# EasyEDA Pro project ProPrj_ProDoc_Board_AI8051U_20240829A_2024-08-30.epro, board PCB_20240829A
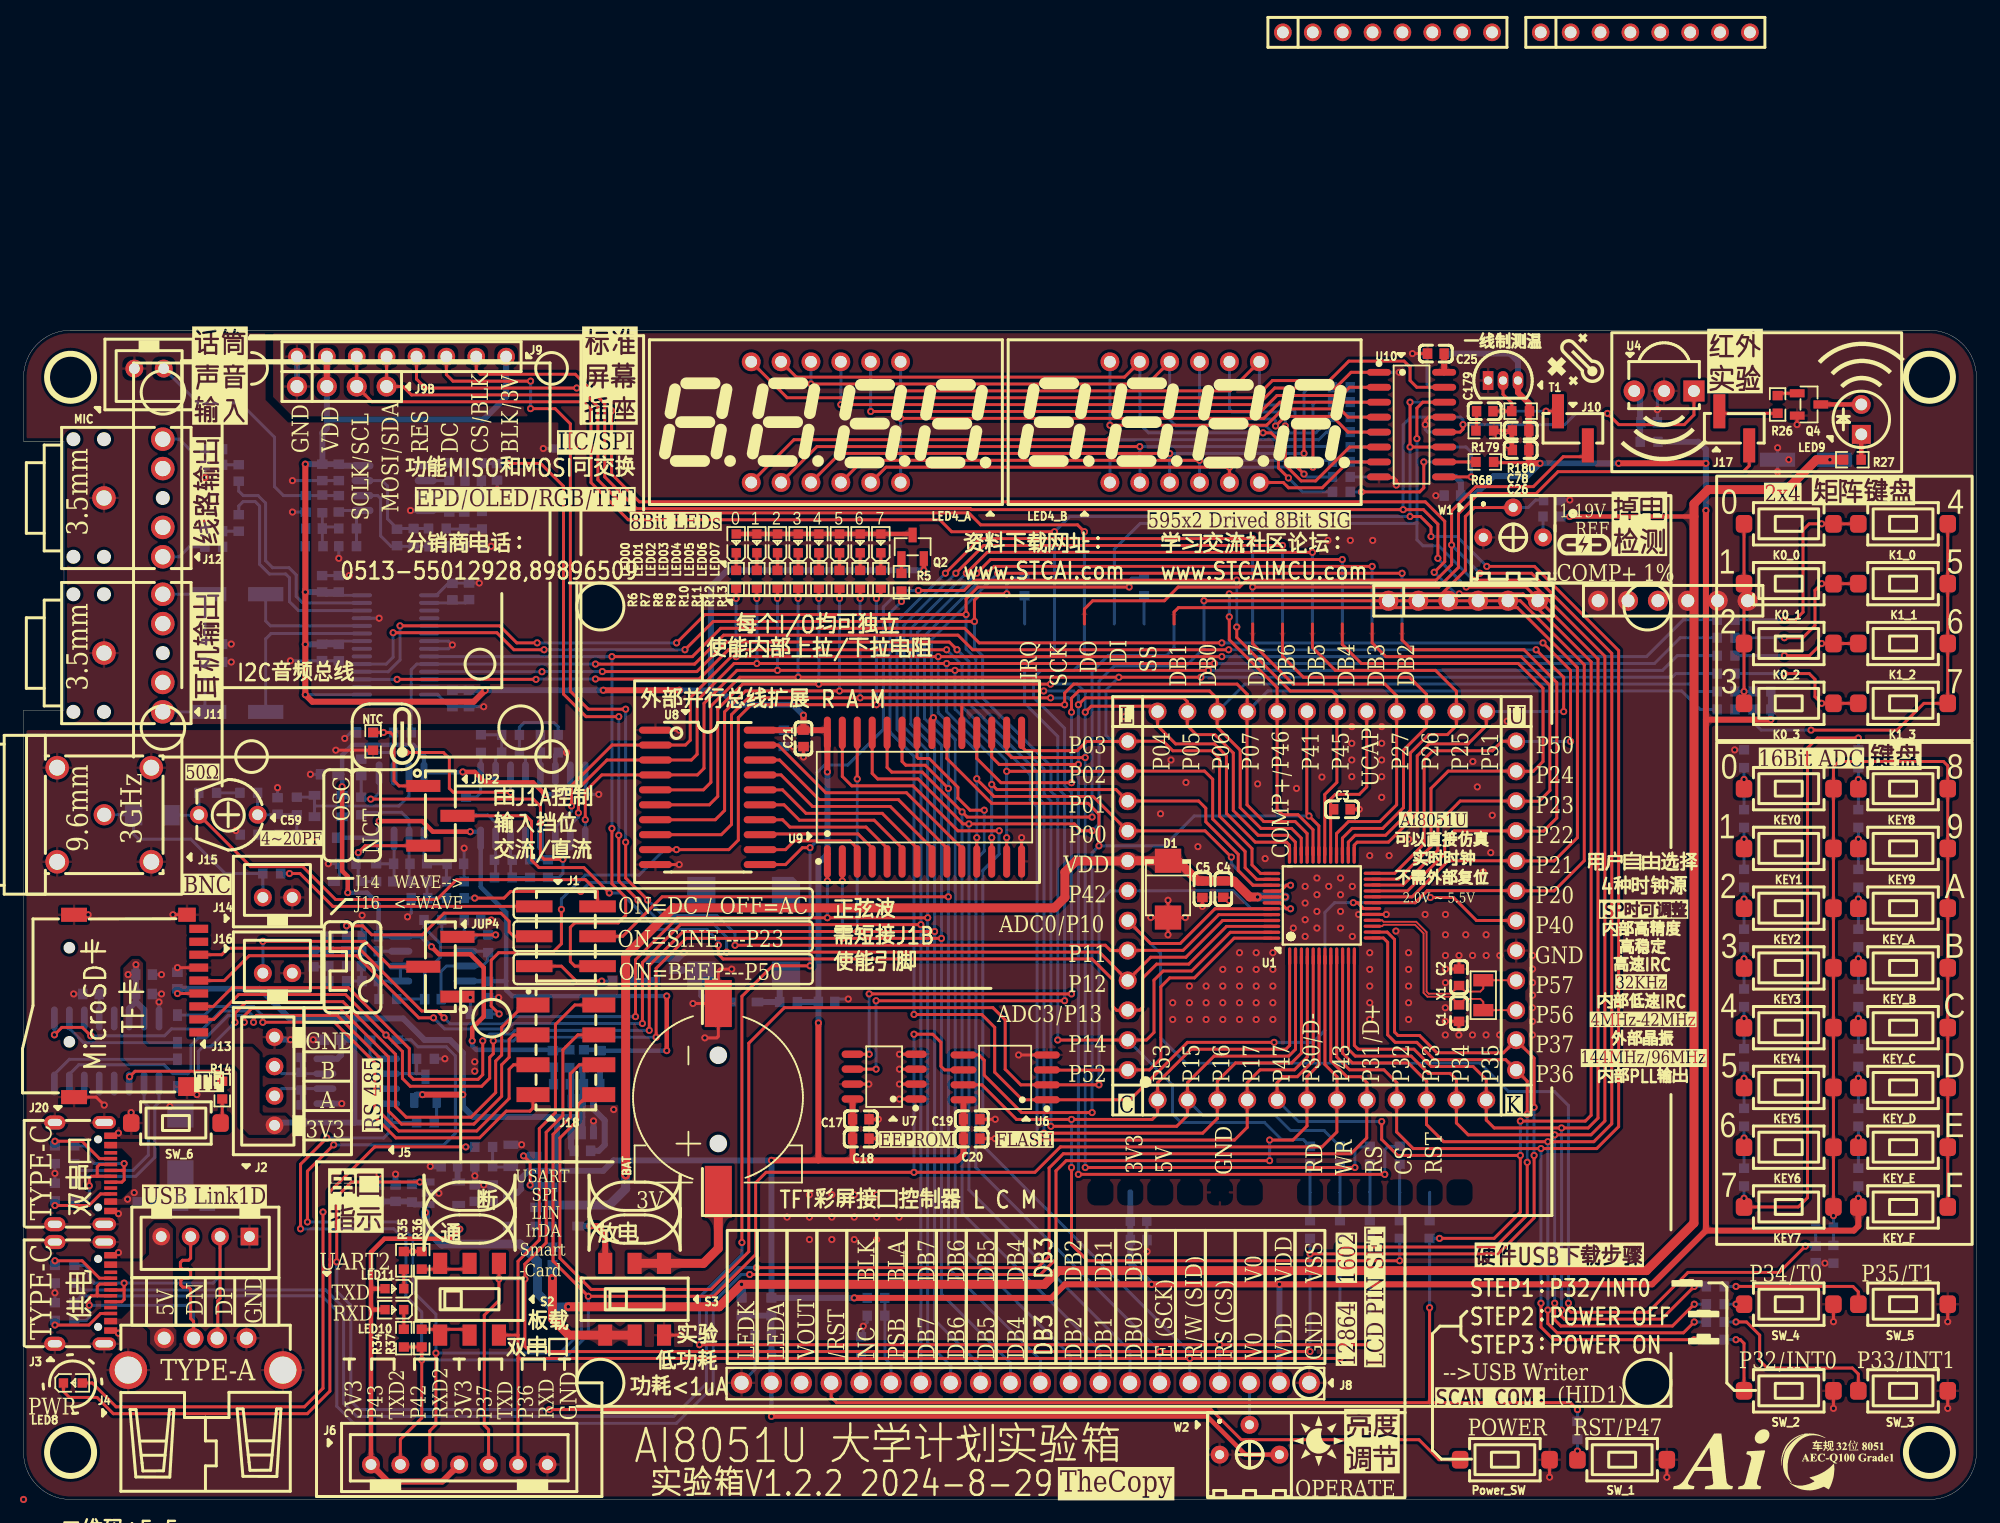
[diagram p6: board, top side]
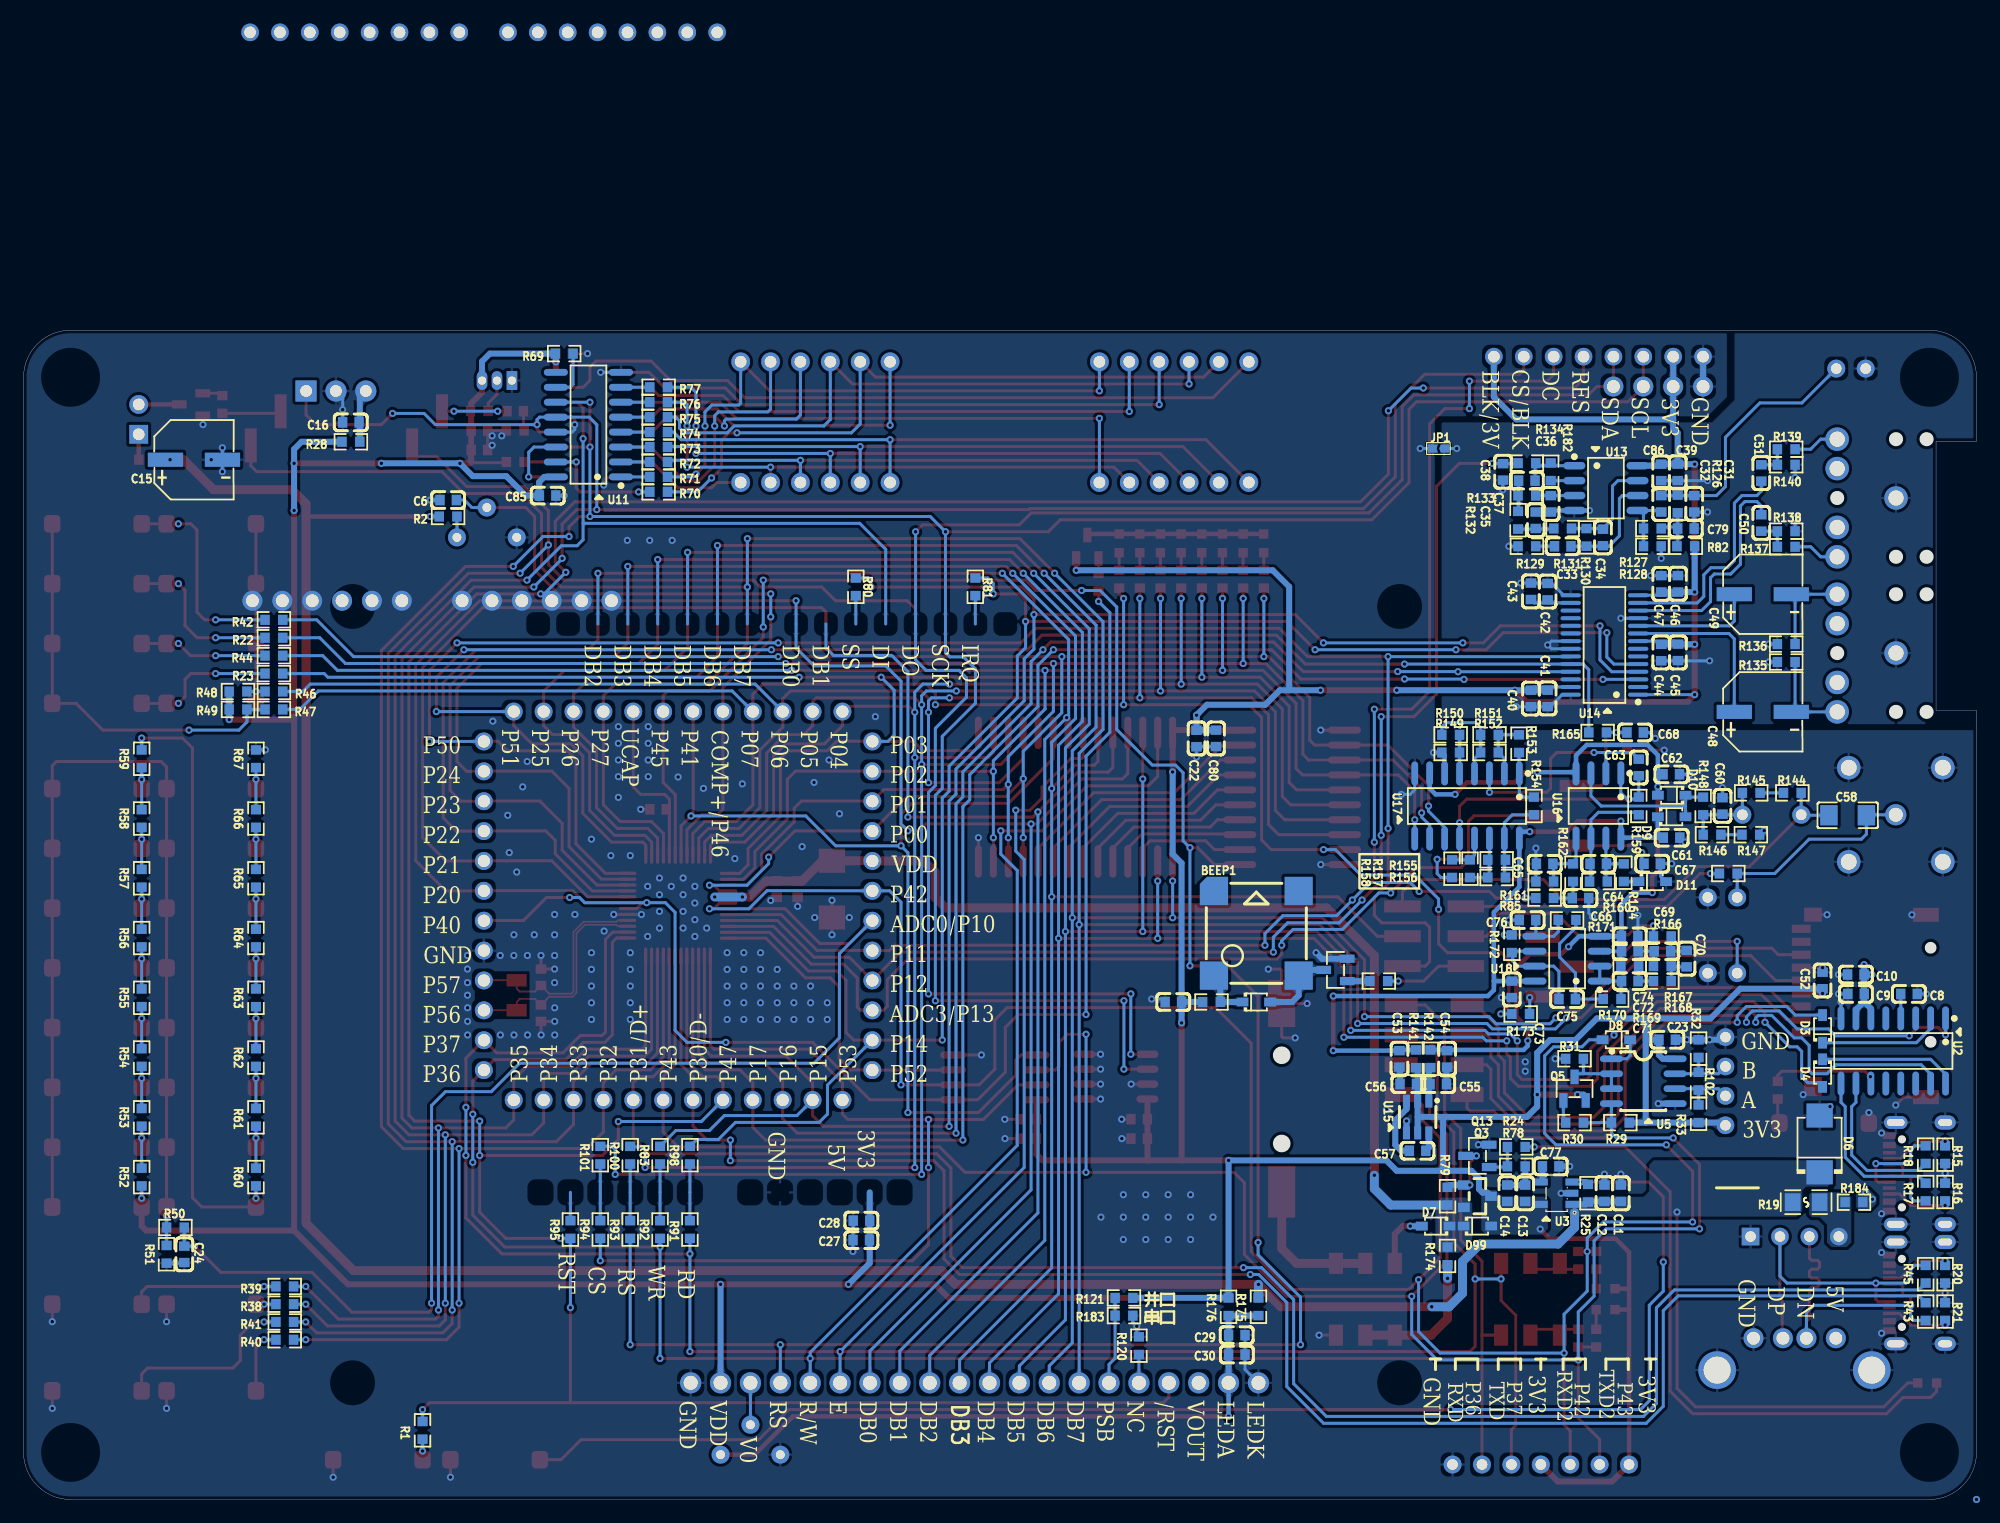
[diagram p7: board, bottom side, seen from below]

Outline 166 x 99.4 mm; copper layers: Top Layer, Bottom Layer. Coordinates in mm from the lower left corner of the outline.
Outline path: 0,95.4 arc(1.17,98.23) 4,99.4 162,99.4 arc(164.83,98.23) 166,95.4 166,4 arc(164.83,1.17) 162,0 4,0 arc(1.17,1.17) 0,4 0,67.08 3.44,67.08 3.44,89.96 0,89.96 0,95.4
Stack: Top Layer 0.035mm / Dielectric1 1.51mm FR4 er 4.5 / Bottom Layer 0.035mm

## Design rules (mm)
template: 自定义配置
spacing copperThickness1oz (default): track to track 0.102, other pairs 0 to 0.3
spacing copperThickness2oz: track to track 0.203, other pairs 0.152 to 0.3
track width copperThickness1oz (default): min 0.127, default 0.254, max 2.54
track width copperThickness2oz: min 0.203, default 0.254, max 2.54
differential pair differentialPair (default): width min 0.127, default 0.254, max 2.54; gap min 0.152, default 0.152
via viaSize (default): diameter min 0.5, default 0.61, max 10; hole min 0.3, default 0.305, max 6.299

## Placement (name value [footprint] x y rotation side)
BAT  KH-CR1220-2  [BAT-SMD_CR1220-2]  59.06 34.16 90 top
BEEP1  -  [FP_BEEP_8.5X8.5]  61.21 48.13 180 bottom
C1  20pF  [C0603]  122.02 41.34 90 top
C2  20pF  [C0603]  122.02 44.39 270 top
C3  100nF  [C0603]  112.06 58.67 180 top
C4  100nF  [C0603]  101.98 51.89 90 top
C5  22uF  [C0603]  100.2 51.88 270 top
C6  1uF  [C0603]  129.9 84.96 180 bottom
C7  22uF  [C0603]  68.26 42.29 180 bottom
C8  100nF  [C0603]  5.73 42.97 180 bottom
C9  100nF  [C0603]  10.24 42.97 180 bottom
C10  22uF  [C0603]  10.25 44.62 0 bottom
C11  22uF  [C0603]  30.23 26.03 90 bottom
C12  100nF  [C0603]  31.62 26.03 270 bottom
C13  22uF  [C0603]  38.36 26.03 90 bottom
C14  100nF  [C0603]  39.88 26.03 270 bottom
C15  220uF  [CAP-SMD_BD6.3-L6.6-W6.6-FD]  151.51 88.39 180 bottom
C16  22uF  [C0603]  138.18 91.57 180 bottom
C17  100nF  [C0603]  71.17 32.33 180 top
C18  22uF  [C0603]  71.17 30.68 0 top
C19  100nF  [C0603]  80.6 32.33 180 top
C20  22uF  [C0603]  80.6 30.68 0 top
C21  100nF  [C0603]  66.29 64.7 90 top
C22  22uF  [C0603]  66.29 64.69 270 bottom
C23  1uF  [C0603]  26.29 39.08 0 bottom
C24  100nF  [C0603]  152.34 20.84 270 bottom
C25  100nF  [C0603]  120.05 97.41 0 top
C26  22uF  [C0603]  127.25 89.22 180 top
C27  22uF  [C0603]  94.79 22.05 0 bottom
C28  100nF  [C0603]  94.78 23.7 180 bottom
C29  22uF  [C0603]  62.87 13.97 180 bottom
C30  100nF  [C0603]  62.87 12.32 0 bottom
C31  1uF  [C0603]  23.99 84.64 90 bottom
C32  100nF  [C0603]  26.8 84.64 90 bottom
C33  1uF  [C0603]  35.17 81.03 180 bottom
C34  10uF  [C0603]  31.75 81.78 270 bottom
C35  4.7nF  [C0603]  37.46 83.24 270 bottom
C36  1nF  [C0603]  38.22 86.61 0 bottom
C37  100pF  [C0603]  36.19 84.64 90 bottom
C38  1nF  [C0603]  40.24 87.36 270 bottom
C39  22uF  [C0603]  25.4 87.31 270 bottom
C40  100nF  [C0603]  37.87 68.1 90 bottom
C41  10uF  [C0603]  36.45 68.1 270 bottom
C42  100nF  [C0603]  36.45 77.18 270 bottom
C43  10uF  [C0603]  37.87 77.21 90 bottom
C44  100nF  [C0603]  25.37 72.01 90 bottom
C45  10uF  [C0603]  26.8 72 270 bottom
C46  100nF  [C0603]  25.38 77.84 270 bottom
C47  10uF  [C0603]  26.79 77.84 90 bottom
C48  100uF  [CAP-SMD_BD6.3-L6.6-W6.6-FD]  18.16 66.96 180 bottom
C49  100uF  [CAP-SMD_BD6.3-L6.6-W6.6-FD]  18.16 76.96 180 bottom
C50  1uF  [C0603]  18.29 83.01 270 bottom
C51  1uF  [C0603]  18.29 87.26 90 bottom
C52  100nF  [C0603]  13.08 44.12 90 bottom
C53  22uF  [C0603]  49.05 37.46 270 bottom
C54  22uF  [C0603]  45 37.46 270 bottom
C55  22uF  [C0603]  45.75 35.31 180 bottom
C56  22uF  [C0603]  48.3 35.31 0 bottom
C57  22uF  [C0603]  47.51 29.64 180 bottom
C58  100nF  [C1206]  10.95 58.17 180 bottom
C59  GKG10015  [CAP-TH_GKGXXX15]  17.4 58.21 180 top
C60  680pF  [C0603]  21.59 58.96 270 bottom
C61  100nF  [C0603]  25.92 56.26 0 bottom
C62  100nF  [C0603]  25.94 61.65 0 bottom
C63  22pF  [C0603]  28.7 62.23 90 bottom
C64  100nF  [C0603]  32.15 54.04 0 bottom
C65  100nF  [C0603]  36.7 54.04 0 bottom
C66  100nF  [C0603]  33.66 51.12 180 bottom
C67  1nF  [C0603]  27.56 54.05 180 bottom
C68  100nF  [C0603]  29.01 65.21 180 bottom
C69  1uF  [C0603]  26.69 46.61 180 bottom
C70  100nF  [C0603]  24.64 45.98 90 bottom
C71  3.9nF  [C0603]  29.46 44.07 180 bottom
C72  10uF  [C0603]  29.46 46.61 180 bottom
C73  100nF  [C0603]  39.49 43.37 90 bottom
C74  100nF  [C0603]  29.48 47.88 0 bottom
C75  3.9nF  [C0603]  34.79 42.54 180 bottom
C76  10uF  [C0603]  38.16 49.26 0 bottom
C77  1uF  [C0603]  36.19 28.32 0 bottom
C78  100nF  [C0603]  127.25 90.87 180 top
C79  22uF  [C0603]  24.7 82.54 180 bottom
C80  100nF  [C0603]  64.64 64.7 90 bottom
C85  100nF  [C0603]  121.45 85.34 0 bottom
C86  100nF  [C0603]  26.8 87.31 90 bottom
C179  100nF  [C0603]  124.21 92.52 0 top
D1  SMBJ5338B  [SMB_L4.6-W3.6-LS5.4-RD]  97.28 51.89 270 top
D2  1N5819WS  [SOD-323_L1.8-W1.3-LS2.5-RD]  61.21 42.29 180 bottom
D3  1N5817WS  [SOD-323_L1.8-W1.3-LS2.5-RD]  13.08 40 90 bottom
D4  1N5817WS  [SOD-323_L1.8-W1.3-LS2.5-RD]  13.08 36.25 270 bottom
D6  SMBJ5338B  [SMB_L4.6-W3.6-LS5.4-RD]  13.33 30.23 90 bottom
D7  1N5817WS  [SOD-323_L1.8-W1.3-LS2.5-RD]  45.97 23.24 0 bottom
D8  1N5817WS  [SOD-323_L1.8-W1.3-LS2.5-RD]  30.61 39.08 0 bottom
D9  1N5817WS  [SOD-323_L1.8-W1.3-LS2.5-RD]  25.91 58.04 180 bottom
D10  1N5817WS  [SOD-323_L1.8-W1.3-LS2.5-RD]  25.91 59.87 0 bottom
D11  1N5817WS  [SOD-323_L1.8-W1.3-LS2.5-RD]  27.56 52.52 180 bottom
D99  1N5817WS  [SOD-323_L1.8-W1.3-LS2.5-RD]  42.42 23.24 180 bottom
J1  PZ254-2-03-S  [HDR-SMD_6P-P2.54-V-M-R2-C3-LS7.5-2]  46.1 47.88 270 top
J2  BX-XH2.54-4PZZ  [CONN-TH_4P-P2.50_BX-XH2.54-4PZZ#2]  15.45 22.35 180 top
J3  TYPE-C 16PIN 2MD(073)  [USB-C-SMD_TYPE-C-6PIN-2MD-073]  5.03 17.56 270 top
J4  AF 90° WJDG  [USB-A-TH_AF-WJDG]  15.47 12.35 0 top
J5  BX-XH2.54-4PZZ  [CONN-TH_4P-P2.50_BX-XH2.54-4PZZ]  21.34 35.56 90 top
J6  BX-HA2.54-7PZZ  [CONN-TH_7P-P2.50_BX-HA2.54-7PZZ]  37.03 2.97 0 top
J7  -  [RHYS_TEST_N01_Package]  82.56 74.43 0 top
J8  2.54-1*20P直针  [HDR-TH_20P-P2.54-V-M-1]  85.16 9.92 180 top
J9  PZ254V-11-08P  [HDR-TH_8P-P2.54-V-M]  32.13 97.16 0 top
J9B  PZ254V-11-04P  [HDR-TH_4P-P2.54-V-M]  27.05 94.62 0 top
J10  DZ254S-11-02-50  [HDR-SMD_2P-P2.54-V-M-S4.8_DZ254S-11-02-50]  131.7 91.06 180 top
J11  PJ-307N5  [AUDIO-TH_PJ-307N5]  9.34 71.96 0 top
J12  PJ-307N5  [AUDIO-TH_PJ-307N5]  9.34 85.14 0 top
J13  TF-01A  [TF-SMD_TF-02]  9.59 41.96 270 top
J14  BX-XH2.54-2PZZ  [CONN-TH_2P-P2.50_BX-XH2.54-2PZZ]  21.59 51.18 0 top
J15  DOSIN-801-0078  [ANT-TH_DOSIN-801-0078]  6.86 58.21 270 top
J16  BX-XH2.54-2PZZ  [CONN-TH_2P-P2.50_BX-XH2.54-2PZZ]  21.59 44.75 0 top
J17  DZ254S-11-02-50  [HDR-SMD_2P-P2.54-V-M-S4.8_DZ254S-11-02-50]  145.41 91.06 180 top
J18  2.54-2*4P立贴针  [HDR-SMD_8P-P2.54-V-M-R2-C4-LS7.4]  46.1 38.23 270 top
J20  TYPE-C 16PIN 2MD(073)  [USB-C-SMD_TYPE-C-6PIN-2MD-073]  5.03 27.72 270 top
JP1  JUMPER  [JUMPER-0603]  45.75 89.35 0 bottom
JUP2  DZ254S-11-03-48  [HDR-TH_3P-P2.54_DZ254S-11-03-48]  35.43 58.12 270 top
JUP4  DZ254S-11-03-48  [HDR-TH_3P-P2.54_DZ254S-11-03-48]  35.43 45.29 90 top
K0_0  TSA363G25-250B  [SW-SMD_L6.1-W3.6-LS8.0]  150.04 82.94 0 top
K0_1  TSA363G25-250B  [SW-SMD_L6.1-W3.6-LS8.0]  150.04 77.86 0 top
K0_2  TSA363G25-250B  [SW-SMD_L6.1-W3.6-LS8.0]  150.04 72.77 0 top
K0_3  TSA363G25-250B  [SW-SMD_L6.1-W3.6-LS8.0]  150.04 67.68 0 top
K1_0  TSA363G25-250B  [SW-SMD_L6.1-W3.6-LS8.0]  159.76 82.94 180 top
K1_1  TSA363G25-250B  [SW-SMD_L6.1-W3.6-LS8.0]  159.76 77.86 180 top
K1_2  TSA363G25-250B  [SW-SMD_L6.1-W3.6-LS8.0]  159.76 72.77 180 top
K1_3  TSA363G25-250B  [SW-SMD_L6.1-W3.6-LS8.0]  159.76 67.68 180 top
KEY0  TSA363G25-250B  [SW-SMD_L6.1-W3.6-LS8.0]  150.04 60.43 180 top
KEY1  TSA363G25-250B  [SW-SMD_L6.1-W3.6-LS8.0]  150.04 55.35 180 top
KEY2  TSA363G25-250B  [SW-SMD_L6.1-W3.6-LS8.0]  150.04 50.27 180 top
KEY3  TSA363G25-250B  [SW-SMD_L6.1-W3.6-LS8.0]  150.04 45.19 180 top
KEY4  TSA363G25-250B  [SW-SMD_L6.1-W3.6-LS8.0]  150.04 40.11 180 top
KEY5  TSA363G25-250B  [SW-SMD_L6.1-W3.6-LS8.0]  150.04 35.03 180 top
KEY6  TSA363G25-250B  [SW-SMD_L6.1-W3.6-LS8.0]  150.04 29.95 180 top
KEY7  TSA363G25-250B  [SW-SMD_L6.1-W3.6-LS8.0]  150.04 24.87 180 top
KEY8  TSA363G25-250B  [SW-SMD_L6.1-W3.6-LS8.0]  159.76 60.43 180 top
KEY9  TSA363G25-250B  [SW-SMD_L6.1-W3.6-LS8.0]  159.76 55.35 180 top
KEY_A  TSA363G25-250B  [SW-SMD_L6.1-W3.6-LS8.0]  159.76 50.27 180 top
KEY_B  TSA363G25-250B  [SW-SMD_L6.1-W3.6-LS8.0]  159.76 45.19 180 top
KEY_C  TSA363G25-250B  [SW-SMD_L6.1-W3.6-LS8.0]  159.76 40.11 180 top
KEY_D  TSA363G25-250B  [SW-SMD_L6.1-W3.6-LS8.0]  159.76 35.03 180 top
KEY_E  TSA363G25-250B  [SW-SMD_L6.1-W3.6-LS8.0]  159.76 29.95 180 top
KEY_F  TSA363G25-250B  [SW-SMD_L6.1-W3.6-LS8.0]  159.76 24.87 180 top
LED00  KT-0603R  [LED0603-RD]  60.58 81.28 90 top
LED01  KT-0603R  [LED0603-RD]  62.34 81.28 90 top
LED02  KT-0603R  [LED0603-RD]  64.09 81.28 90 top
LED03  KT-0603R  [LED0603-RD]  65.85 81.28 90 top
LED04  KT-0603R  [LED0603-RD]  67.6 81.28 90 top
LED4_A  SR410361N  [LED-SEG-TH_12P-L30.0-W14.0-P2.54-S10.26-BL]  68.2 91.59 0 top
LED4_B  SR410361N  [LED-SEG-TH_12P-L30.0-W14.0-P2.54-S10.26-BL]  98.69 91.59 0 top
LED05  KT-0603R  [LED0603-RD]  69.36 81.28 90 top
LED06  KT-0603R  [LED0603-RD]  71.12 81.28 90 top
LED07  KT-0603R  [LED0603-RD]  72.87 81.28 90 top
LED8  KT-0603R  [LED0603-RD]  4.19 9.91 0 top
LED9  IR204-A  [LED-TH_BD4.8-P2.54-FD]  156.21 91.82 90 top
LED10  KT-0603R  [LED0603-RD]  31.52 16.14 180 top
LED11  KT-0603R  [LED0603-RD]  31.52 17.92 180 top
MIC  BX-XH2.54-2PZZ  [CONN-TH_2P-P2.50_BX-XH2.54-2PZZ]  10.67 96.14 180 top
NTC  SDNT1608X103F3950FTF  [R0603]  29.71 64.45 90 top
Power_SW  TSA363G25-250B  [SW-SMD_L6.1-W3.6-LS8.0]  125.91 3.38 0 top
Q1  SS8050  [SOT-23-3_L2.9-W1.3-P1.90-LS2.4-BR]  54.48 45.02 180 bottom
Q2  SS8550 Y2  [SOT-23-3_L2.9-W1.3-P1.90-LS2.4-BR]  75.57 80.99 270 top
Q3  AO3401A  [SOT-23_L2.9-W1.3-P1.90-LS2.4-BR]  42.42 25.78 0 bottom
Q4  SS8050  [SOT-23-3_L2.9-W1.3-P1.90-LS2.4-BR]  151.76 93.09 180 top
Q5  SS8550 Y2  [SOT-23-3_L2.9-W1.3-P1.90-LS2.4-BR]  34.16 34.92 270 bottom
Q13  SS8050  [SOT-23-3_L2.9-W1.3-P1.90-LS2.4-BR]  42.42 29.21 180 bottom
R1  300Ω  [R0603]  132.08 5.88 90 bottom
R2  100kΩ  [R0603]  129.91 83.57 0 bottom
R3  4.7kΩ  [R0603]  50.8 44.07 180 bottom
R4  10Ω  [R0603]  65.02 42.29 0 bottom
R5  3.3kΩ  [R0603]  74.62 77.98 270 top
R6  3.3kΩ  [R0603]  60.57 78.23 270 top
R7  3.3kΩ  [R0603]  62.33 78.23 270 top
R8  3.3kΩ  [R0603]  64.09 78.23 270 top
R9  3.3kΩ  [R0603]  65.84 78.23 270 top
R10  3.3kΩ  [R0603]  67.6 78.23 270 top
R11  3.3kΩ  [R0603]  69.36 78.23 270 top
R12  3.3kΩ  [R0603]  71.11 78.23 270 top
R13  3.3kΩ  [R0603]  72.87 78.23 270 top
R14  300Ω  [R0603]  16.89 34.8 90 top
R15  5.1kΩ  [R0603]  2.67 29.31 90 bottom
R16  5.1kΩ  [R0603]  2.67 26.14 270 bottom
R17  33Ω  [R0603]  4.32 26.14 270 bottom
R18  33Ω  [R0603]  4.32 29.31 90 bottom
R19  SMD0805B050TF  [F0805]  14.48 25.27 0 bottom
R20  5.1kΩ  [R0603]  2.67 19.15 90 bottom
R21  5.1kΩ  [R0603]  2.67 15.97 270 bottom
R22  300Ω  [R0603]  144.72 73.26 180 bottom
R23  300Ω  [R0603]  144.72 70.21 180 bottom
R24  2kΩ  [R0603]  39.12 29.97 180 bottom
R25  10kΩ  [R0603]  33.02 26.03 270 bottom
R26  1kΩ  [R0603]  149.1 93.09 270 top
R27  10Ω  [R0603]  155.45 88.39 180 top
R28  100Ω  [R0603]  138.18 89.92 0 bottom
R29  10kΩ  [R0603]  30.27 32.04 0 bottom
R30  10kΩ  [R0603]  34.16 32.04 0 bottom
R31  3.3kΩ  [R0603]  34.16 37.47 0 bottom
R32  3.3kΩ  [R0603]  23.62 38.33 90 bottom
R33  3.3kΩ  [R0603]  23.62 32.79 90 bottom
R34  3.3kΩ  [R0603]  32.32 13.72 90 top
R35  3.3kΩ  [R0603]  32.32 20.33 90 top
R36  33Ω  [R0603]  33.85 20.33 270 top
R37  33Ω  [R0603]  33.85 13.72 90 top
R38  300Ω  [R0603]  143.8 16.6 180 bottom
R39  300Ω  [R0603]  143.8 18.11 180 bottom
R40  300Ω  [R0603]  143.8 13.58 180 bottom
R41  300Ω  [R0603]  143.8 15.09 180 bottom
R42  300Ω  [R0603]  144.72 74.78 180 bottom
R43  33Ω  [R0603]  4.32 15.97 270 bottom
R44  300Ω  [R0603]  144.72 71.73 180 bottom
R45  33Ω  [R0603]  4.32 19.15 90 bottom
R46  300Ω  [R0603]  144.72 68.69 180 bottom
R47  300Ω  [R0603]  144.72 67.16 180 bottom
R48  10kΩ  [R0603]  147.77 68.69 0 bottom
R49  10kΩ  [R0603]  147.77 67.16 0 bottom
R50  1kΩ  [R0603]  153.09 23.12 180 bottom
R51  100kΩ  [R0603]  153.84 20.84 90 bottom
R52  300Ω  [R0603]  155.96 27.41 90 bottom
R53  300Ω  [R0603]  155.96 32.49 90 bottom
R54  300Ω  [R0603]  155.96 37.57 90 bottom
R55  300Ω  [R0603]  155.96 42.65 90 bottom
R56  300Ω  [R0603]  155.96 47.73 90 bottom
R57  300Ω  [R0603]  155.96 52.81 90 bottom
R58  300Ω  [R0603]  155.96 57.89 90 bottom
R59  300Ω  [R0603]  155.96 62.97 90 bottom
R60  300Ω  [R0603]  146.24 27.41 90 bottom
R61  300Ω  [R0603]  146.24 32.49 90 bottom
R62  300Ω  [R0603]  146.24 37.57 90 bottom
R63  300Ω  [R0603]  146.24 42.65 90 bottom
R64  300Ω  [R0603]  146.24 47.73 90 bottom
R65  300Ω  [R0603]  146.24 52.81 90 bottom
R66  300Ω  [R0603]  146.24 57.89 90 bottom
R67  300Ω  [R0603]  146.24 62.97 90 bottom
R68  3.3kΩ  [R0603]  124.21 88.2 180 top
R69  3.3kΩ  [R0603]  120.04 97.41 180 bottom
R70  300Ω  [R0603]  112.01 85.66 180 bottom
R71  300Ω  [R0603]  112.01 86.93 180 bottom
R72  300Ω  [R0603]  112.01 88.2 180 bottom
R73  300Ω  [R0603]  112.01 89.47 180 bottom
R74  300Ω  [R0603]  112.01 90.74 180 bottom
R75  300Ω  [R0603]  112.01 92.01 180 bottom
R76  300Ω  [R0603]  112.01 93.28 180 bottom
R77  300Ω  [R0603]  112.01 94.55 180 bottom
R78  1kΩ  [R0603]  39.12 28.32 0 bottom
R79  10kΩ  [R0603]  44.96 25.78 90 bottom
R80  100Ω  [R0603]  95.26 77.59 90 bottom
R81  100Ω  [R0603]  85.1 77.59 90 bottom
R82  1kΩ  [R0603]  24.7 81.04 180 bottom
R83  100Ω  [R0603]  111.9 29.27 270 bottom
R85  10kΩ  [R0603]  36.7 51.13 0 bottom
R91  100Ω  [R0603]  109.36 22.95 270 bottom
R92  100Ω  [R0603]  111.9 22.95 270 bottom
R93  100Ω  [R0603]  114.44 22.95 270 bottom
R94  100Ω  [R0603]  116.98 22.95 270 bottom
R95  100Ω  [R0603]  119.52 22.95 270 bottom
R98  100Ω  [R0603]  109.36 29.27 270 bottom
R100  100Ω  [R0603]  114.44 29.27 270 bottom
R101  100Ω  [R0603]  116.98 29.27 270 bottom
R102  120Ω  [R0603]  23.62 35.56 90 bottom
R120  0Ω  [R0603]  71.19 13.07 270 bottom
R121  4.7kΩ  [R0603]  72.46 17.14 0 bottom
R126  3kΩ  [R0603]  25.4 84.64 270 bottom
R127  100kΩ  [R0603]  27.55 82.54 180 bottom
R128  100kΩ  [R0603]  27.55 81.04 180 bottom
R129  1kΩ  [R0603]  38.21 81.04 180 bottom
R130  51kΩ  [R0603]  33.15 81.79 270 bottom
R131  10kΩ  [R0603]  35.18 82.54 0 bottom
R132  68kΩ  [R0603]  38.97 83.25 270 bottom
R133  68kΩ  [R0603]  38.21 85.34 0 bottom
R134  1kΩ  [R0603]  38.21 88.1 180 bottom
R135  100kΩ  [R0603]  16.17 71.19 0 bottom
R136  100kΩ  [R0603]  16.17 72.72 0 bottom
R137  1kΩ  [R0603]  16.17 80.99 180 bottom
R138  100kΩ  [R0603]  16.17 82.31 180 bottom
R139  1kΩ  [R0603]  16.17 89.28 180 bottom
R140  100kΩ  [R0603]  16.17 87.96 180 bottom
R141  10Ω  [R0603]  47.63 37.47 90 bottom
R142  10Ω  [R0603]  46.42 37.47 90 bottom
R143  100Ω  [R0603]  21.09 53.21 0 bottom
R144  680kΩ  [R0603]  15.65 60.07 180 bottom
R145  300kΩ  [R0603]  19.15 60.07 180 bottom
R146  270Ω  [R0603]  22.48 56.52 0 bottom
R147  16kΩ  [R0603]  19.18 56.52 0 bottom
R148  200Ω  [R0603]  23.23 58.95 90 bottom
R149  20Ω  [R0603]  44.69 63.5 180 bottom
R150  20Ω  [R0603]  44.69 65.01 180 bottom
R151  120Ω  [R0603]  41.4 65.01 180 bottom
R152  120Ω  [R0603]  41.4 63.5 180 bottom
R153  100Ω  [R0603]  38.88 64.25 90 bottom
R154  200Ω  [R0603]  37.61 58.95 90 bottom
R155  1.2kΩ  [R0603]  40.79 54.38 0 bottom
R156  1.2kΩ  [R0603]  40.79 52.87 0 bottom
R157  1kΩ  [R0603]  43.05 53.63 270 bottom
R158  2kΩ  [R0603]  44.58 53.63 90 bottom
R159  1kΩ  [R0603]  28.7 58.95 270 bottom
R160  2kΩ  [R0603]  32.13 52.53 0 bottom
R161  10kΩ  [R0603]  36.7 52.53 180 bottom
R162  10kΩ  [R0603]  34.29 53.29 270 bottom
R164  200Ω  [R0603]  29.97 53.29 270 bottom
R165  10kΩ  [R0603]  32.2 65.21 0 bottom
R166  15kΩ  [R0603]  26.7 47.88 0 bottom
R167  100kΩ  [R0603]  26.7 45.34 0 bottom
R168  51kΩ  [R0603]  26.7 44.07 180 bottom
R169  51kΩ  [R0603]  29.47 45.34 180 bottom
R170  51kΩ  [R0603]  30.97 42.54 180 bottom
R171  51kΩ  [R0603]  34.8 49.27 180 bottom
R172  200Ω  [R0603]  39.5 47.24 90 bottom
R173  200Ω  [R0603]  38.74 41.28 0 bottom
R174  1kΩ  [R0603]  44.96 20.7 90 bottom
R175  0Ω  [R0603]  61.03 16.38 270 bottom
R176  0Ω  [R0603]  63.57 16.38 270 bottom
R179  10kΩ  [R0603]  124.21 90.87 180 top
R180  4.7kΩ  [R0603]  127.25 92.52 0 top
R182  0Ω  [R0603]  36.19 87.37 270 bottom
R183  4.7kΩ  [R0603]  72.46 15.63 0 bottom
R184  10Ω  [R0603]  10.41 25.27 180 bottom
S1  -  [FP_LQFP-48-MiniCore]  95.12 35.23 0 top
S2  SS-3235S-L1  [SW-SMD_SS-3235S-LX]  37.91 17.02 180 top
S3  SS-3235S-L1  [SW-SMD_SS-3235S-LX]  51.94 17.02 180 top
SW_1  TSA363G25-250B  [SW-SMD_L6.1-W3.6-LS8.0]  135.88 3.38 0 top
SW_2  TSA363G25-250B  [SW-SMD_L6.1-W3.6-LS8.0]  150.04 9.23 0 top
SW_3  TSA363G25-250B  [SW-SMD_L6.1-W3.6-LS8.0]  159.76 9.23 0 top
SW_4  TSA363G25-250B  [SW-SMD_L6.1-W3.6-LS8.0]  150.04 16.6 0 top
SW_5  TSA363G25-250B  [SW-SMD_L6.1-W3.6-LS8.0]  159.76 16.6 0 top
SW_6  TSA363G25-250B  [SW-SMD_L6.1-W3.6-LS8.0]  12.95 32 180 top
T1  DS18B20  [TO-92-3_L4.9-W3.7-P1.27-L]  125.76 95.12 0 top
U1  STC8051U  [LQFP-48_48P-L7.0-W7.0-P0.50-LS9.0-BL]  110.36 50.49 0 top
U2  STC8H2K12U-45I-SOP16  [SOP-16_L9.9-W3.9-P1.27-LS6.0-BL]  7.07 38.13 0 bottom
U3  ME6213C33M5G  [SOT-23-5_L3.0-W1.7-P0.95-LS2.8-BR]  35.69 26.03 180 bottom
U4  IRM-3638T  [OPTO-TH_IRM-3638T]  139.45 94.23 180 top
U5  SP3485EN-L/TR  [SOIC-8_L5.0-W4.0-P1.27-LS6.0-BL]  28.32 35.56 270 bottom
U6  W25Q80BV  [SOP-8_L5.3-W5.2-P1.27-LS7.9-BL]  83.44 35.88 90 top
U7  AT24C02  [SOP-8_L4.9-W3.9-P1.27-LS6.0-BL]  73.15 35.95 90 top
U8  CD74HC573M96  [SOIC-20_L12.8-W7.5-P1.27-LS10.3-BL]  58.17 59.69 270 top
U9  IS62C256AL-45ULI-TR  [SOIC-28_L17.9-W8.4-P1.27-LS12.7-BL]  76.58 59.71 0 top
U10  74HC595  [SOP-16_L9.9-W3.9-P1.27-LS6.0-BL]  117.98 91.38 270 top
U11  74HC595  [SOP-16_L9.9-W3.9-P1.27-LS6.0-BL]  117.98 91.38 90 bottom
U13  LMV358  [SOP-8_L4.9-W3.9-P1.27-LS6.0-BL]  31.5 85.98 270 bottom
U14  TLV320AIC23BIPWR  [TSSOP-28_L9.7-W4.4-P0.65-LS6.4-BL]  31.62 72.64 90 bottom
U15  SGM3204 SOT23-6  [SOT-23-6_L2.9-W1.6-P0.95-LS2.8-BR]  47.5 32.51 90 bottom
U16  TP2604S  [SOIC-8_L4.9-W3.9-P1.27-LS6.0-BL]  32.13 58.95 0 bottom
U17  74HC4051  [SOP-16_L9.9-W3.9-P1.27-LS6.0-BL]  43.3 58.95 0 bottom
U18  TP2604S  [SOIC-8_L4.9-W3.9-P1.27-LS6.0-BL]  34.8 45.97 90 bottom
W1  100kΩ  [RES-ADJ-TH_3362P]  126.62 83.06 0 top
W2  100kΩ  [RES-ADJ-TH_3362P]  104.21 5.08 0 top
X1  32.768kHz  [OSC-SMD_L3.2-W1.5]  124.08 42.87 90 top

## Footprints (pads in the part's own frame, mm; a bottom-side part is the same pattern mirrored in y, then rotated)
ANT-TH_DOSIN-801-0078
  round 1.8 hole 1.2: 1(0,0)
  round 2 hole 1.35: 2(-4,4) 3(4,4) 4(4,-4) 5(-4,-4)
AUDIO-TH_PJ-307N5
  round 2 hole 1.3: 1(-2.5,0) 2(2.5,-5) 3(2.5,5) 4(2.5,-2.5) 5(2.5,2.5)
BAT-SMD_CR1220-2
  rect 4.4x2.3 smd: 1(-8,0)
  rect 4x2.3 smd: 2(8,0)
C0603
  rect 0.8x0.9 smd: 1(-0.7,0) 2(0.7,0)
C1206
  rect 1.485x1.728 smd: 1(-1.593,0) 2(1.593,0)
CAP-SMD_BD6.3-L6.6-W6.6-FD
  rect 3x1.2 smd: 1(-2.425,0) 2(2.42,0)
CAP-TH_GKGXXX15
  round 1.524 hole 0.914: 1(-2.5,0) 2(2.5,0)
CONN-TH_2P-P2.50_BX-XH2.54-2PZZ
  rrect 1.524x1.524 hole 0.914: 1(-1.25,0) 2(1.25,0)
CONN-TH_4P-P2.50_BX-XH2.54-4PZZ
  rrect 1.5x1.5 hole 0.9: 1(-3.75,0) 2(-1.25,0) 3(1.25,0) 4(3.75,0)
CONN-TH_4P-P2.50_BX-XH2.54-4PZZ#2
  rect 1.5x1.5 hole 0.9: 1(-3.75,0)
  round 1.5 hole 0.9: 2(-1.25,0) 3(1.25,0) 4(3.75,0)
CONN-TH_7P-P2.50_BX-HA2.54-7PZZ
  rrect 1.524x1.524 hole 0.914: 1(-7.5,0) 2(-5,0) 3(-2.5,0) 4(0,0) 5(2.5,0) 6(5,0) 7(7.5,0)
F0805
  rect 1.335x1.5 smd: 1(-1.143,0) 2(1.143,0)
FP_BEEP_8.5X8.5
  rect 2.4x2.4 smd: 1(-3.6,-3.6) 2(3.6,-3.6) 3(3.599,3.599)
  custom 2.401x2.403 smd: 4(-3.6,3.599)
FP_LQFP-48-MiniCore
  rrect 1.524x1.524 hole 1.05: 1(1.27,-1.27) 2(3.81,-1.27) 3(6.35,-1.27) 4(8.89,-1.27) 5(11.43,-1.27) 6(13.97,-1.27) 7(16.51,-1.27) 8(19.05,-1.27) 9(21.59,-1.27) 10(24.13,-1.27) 11(26.67,-1.27) 12(29.21,-1.27) 13(31.75,1.27) 14(31.75,3.81) 15(31.75,6.35) 16(31.75,8.89) 17(31.75,11.43) 18(31.75,13.97) 19(31.75,16.51) 20(31.75,19.05) 21(31.75,21.59) 22(31.75,24.13) 23(31.75,26.67) 24(31.75,29.21) 25(29.21,31.75) 26(26.67,31.75) 27(24.13,31.75) 28(21.59,31.75) 29(19.05,31.75) 30(16.51,31.75) 31(13.97,31.75) 32(11.43,31.75) 33(8.89,31.75) 34(6.35,31.75) 35(3.81,31.75) 36(1.27,31.75) 37(-1.27,29.21) 38(-1.27,26.67) 39(-1.27,24.13) 40(-1.27,21.59) 41(-1.27,19.05) 42(-1.27,16.51) 43(-1.27,13.97) 44(-1.27,11.43) 45(-1.27,8.89) 46(-1.27,6.35) 47(-1.27,3.81) 48(-1.27,1.27)
HDR-SMD_2P-P2.54-V-M-S4.8_DZ254S-11-02-50
  rect 1.02x2.9 smd: 1(-1.27,1.45) 2(1.27,-1.45)
HDR-SMD_6P-P2.54-V-M-R2-C3-LS7.5-2
  rect 1.02x3.1 smd: 1(-2.54,-2.69) 2(-2.54,2.69) 3(0,-2.69) 4(0,2.69) 5(2.54,-2.69) 6(2.54,2.69)
HDR-SMD_8P-P2.54-V-M-R2-C4-LS7.4
  rect 1.27x2.8 smd: 1(-3.81,-2.8) 2(-3.81,2.8) 3(-1.27,-2.8) 4(-1.27,2.8) 5(1.27,-2.8) 6(1.27,2.8) 7(3.81,-2.8) 8(3.81,2.794)
HDR-TH_3P-P2.54_DZ254S-11-03-48
  rect 1.02x2.9 smd: 1(-2.54,-1.45) 2(0,1.45) 3(2.54,-1.45)
HDR-TH_4P-P2.54-V-M
  rrect 1.7x1.7 hole 1.1: 1(-3.81,0) 2(-1.27,0) 3(1.27,0) 4(3.81,0)
HDR-TH_8P-P2.54-V-M
  rrect 1.5x1.5 hole 1: 1(-8.89,0) 2(-6.35,0) 3(-3.81,0) 4(-1.27,0) 5(1.27,0) 6(3.81,0) 7(6.35,0) 8(8.89,0)
HDR-TH_20P-P2.54-V-M-1
  rrect 1.8x1.8 hole 1.2: 1(-24.13,0) 2(-21.59,0) 3(-19.05,0) 4(-16.51,0) 5(-13.97,0) 6(-11.43,0) 7(-8.89,0) 8(-6.35,0) 9(-3.81,0) 10(-1.27,0) 11(1.27,0) 12(3.81,0) 13(6.35,0) 14(8.89,0) 15(11.43,0) 16(13.97,0) 17(16.51,0) 18(19.05,0) 19(21.59,0) 20(24.13,0)
JUMPER-0603
  custom 0.853x0.708 smd: 1(0.45,0.006)
  custom 0.843x0.706 smd: 2(-0.5,0.005)
LED0603-RD
  rect 0.8x0.8 smd: 1(-0.799,0) 2(0.799,0)
LED-SEG-TH_12P-L30.0-W14.0-P2.54-S10.26-BL
  round 1.6 hole 1: 1(-6.35,-5.13) 2(-3.81,-5.13) 3(-1.27,-5.13) 4(1.27,-5.13) 5(3.81,-5.13) 6(6.35,-5.13) 7(6.35,5.13) 8(3.81,5.13) 9(1.27,5.13) 10(-1.27,5.13) 11(-3.81,5.13) 12(-6.35,5.13)
LED-TH_BD4.8-P2.54-FD
  rect 1.6x1.6 hole 1: 1(-1.27,0)
  round 1.6 hole 1: 2(1.27,0)
LQFP-48_48P-L7.0-W7.0-P0.50-LS9.0-BL
  oval 0.28x1.5 smd: 1(-2.743,-4.306) 2(-2.243,-4.306) 3(-1.742,-4.306) 4(-1.242,-4.306) 5(-0.742,-4.306) 6(-0.241,-4.306) 7(0.257,-4.306) 8(0.757,-4.306) 9(1.258,-4.306) 10(1.758,-4.306) 11(2.258,-4.306) 12(2.759,-4.306) 25(2.743,4.306) 26(2.243,4.306) 27(1.742,4.306) 28(1.242,4.306) 29(0.742,4.306) 30(0.241,4.306) 31(-0.257,4.306) 32(-0.757,4.306) 33(-1.258,4.306) 34(-1.758,4.306) 35(-2.258,4.306) 36(-2.759,4.306)
  oval 1.5x0.28 smd: 13(4.293,-2.756) 14(4.293,-2.256) 15(4.293,-1.755) 16(4.293,-1.255) 17(4.293,-0.754) 18(4.293,-0.254) 19(4.293,0.244) 20(4.293,0.744) 21(4.293,1.244) 22(4.293,1.745) 23(4.293,2.245) 24(4.293,2.745) 37(-4.293,2.731) 38(-4.293,2.23) 39(-4.293,1.73) 40(-4.293,1.23) 41(-4.293,0.729) 42(-4.293,0.229) 43(-4.293,-0.269) 44(-4.293,-0.769) 45(-4.293,-1.27) 46(-4.293,-1.77) 47(-4.293,-2.271) 48(-4.293,-2.771)
OPTO-TH_IRM-3638T
  rect 1.8x1.8 hole 1: 1(-2.54,0)
  round 1.8 hole 1: 2(0,0) 3(2.54,0)
OSC-SMD_L3.2-W1.5
  rect 1.05x1.7 smd: 1(-1.275,0) 2(1.275,0)
R0603
  rect 0.806x0.864 smd: 1(-0.753,0) 2(0.753,0)
RES-ADJ-TH_3362P
  round 1.524 hole 0.762: 1(-2.54,-1.27) 2(0,1.27) 3(2.54,-1.27)
RHYS_TEST_N01_Package
  rrect 1.5x1.5 hole 1: 1(24.488,50.295) 2(27.028,50.295) 3(29.568,50.295) 4(32.108,50.295) 5(34.648,50.295) 6(37.188,50.295) 7(39.728,50.295) 8(42.268,50.295) 9(46.408,50.295) 10(48.948,50.295) 11(51.488,50.295) 12(54.028,50.295) 13(56.568,50.295) 14(59.108,50.295) 15(61.648,50.295) 16(64.188,50.295)
  rrect 1.7x1.7 hole 1.1: 17(63.988,1.975) 18(61.448,1.975) 19(58.908,1.975) 20(56.368,1.975) 21(53.828,1.975) 22(51.288,1.975) 23(46.168,1.975) 24(43.628,1.975) 25(41.088,1.975) 26(38.548,1.975) 27(36.008,1.975) 28(33.468,1.975)
SMB_L4.6-W3.6-LS5.4-RD
  rect 2.047x2.241 smd: 1(-2.413,0) 2(2.413,0)
SOD-323_L1.8-W1.3-LS2.5-RD
  rect 1x0.75 smd: 1(-1.173,0) 2(1.173,0)
SOIC-8_L4.9-W3.9-P1.27-LS6.0-BL
  oval 0.588x2.045 smd: 1(-1.905,-2.772) 2(-0.635,-2.772) 3(0.635,-2.772) 4(1.905,-2.772) 5(1.905,2.772) 6(0.635,2.772) 7(-0.635,2.772) 8(-1.905,2.772)
SOIC-8_L5.0-W4.0-P1.27-LS6.0-BL
  oval 0.569x1.95 smd: 1(-1.905,-2.705) 2(-0.635,-2.705) 3(0.635,-2.705) 4(1.905,-2.705) 5(1.905,2.705) 6(0.635,2.705) 7(-0.635,2.705) 8(-1.905,2.705)
SOIC-20_L12.8-W7.5-P1.27-LS10.3-BL
  oval 0.6x2.8 smd: 1(-5.715,-4.45) 2(-4.445,-4.45) 3(-3.175,-4.45) 4(-1.905,-4.45) 5(-0.635,-4.45) 6(0.635,-4.45) 7(1.905,-4.45) 8(3.175,-4.45) 9(4.445,-4.45) 10(5.715,-4.45) 11(5.715,4.45) 12(4.445,4.45) 13(3.175,4.45) 14(1.905,4.45) 15(0.635,4.45) 16(-0.635,4.45) 17(-1.905,4.45) 18(-3.175,4.45) 19(-4.445,4.45) 20(-5.715,4.45)
SOIC-28_L17.9-W8.4-P1.27-LS12.7-BL
  oval 0.595x2.766 smd: 1(-8.255,-5.465) 2(-6.985,-5.465) 3(-5.715,-5.465) 4(-4.445,-5.465) 5(-3.175,-5.465) 6(-1.905,-5.465) 7(-0.635,-5.465) 8(0.635,-5.465) 9(1.905,-5.465) 10(3.175,-5.465) 11(4.445,-5.465) 12(5.715,-5.465) 13(6.985,-5.465) 14(8.255,-5.465) 15(8.255,5.465) 16(6.985,5.465) 17(5.715,5.465) 18(4.445,5.465) 19(3.175,5.465) 20(1.905,5.465) 21(0.635,5.465) 22(-0.635,5.465) 23(-1.905,5.465) 24(-3.175,5.465) 25(-4.445,5.465) 26(-5.715,5.465) 27(-6.985,5.465) 28(-8.255,5.465)
SOP-8_L4.9-W3.9-P1.27-LS6.0-BL
  oval 0.63x1.865 smd: 1(-1.905,-2.683) 2(-0.635,-2.683) 3(0.635,-2.683) 4(1.905,-2.683) 5(1.905,2.683) 6(0.635,2.683) 7(-0.635,2.683) 8(-1.905,2.683)
SOP-8_L5.3-W5.2-P1.27-LS7.9-BL
  oval 0.609x2.204 smd: 1(-1.905,-3.542) 2(-0.635,-3.542) 3(0.635,-3.542) 4(1.905,-3.542) 5(1.905,3.542) 6(0.635,3.542) 7(-0.635,3.542) 8(-1.905,3.542)
SOP-16_L9.9-W3.9-P1.27-LS6.0-BL
  oval 0.574x2.038 smd: 1(-4.445,-2.769) 2(-3.175,-2.769) 3(-1.905,-2.769) 4(-0.635,-2.769) 5(0.635,-2.769) 6(1.905,-2.769) 7(3.175,-2.769) 8(4.445,-2.769) 9(4.445,2.769) 10(3.175,2.769) 11(1.905,2.769) 12(0.635,2.769) 13(-0.635,2.769) 14(-1.905,2.769) 15(-3.175,2.769) 16(-4.445,2.769)
SOT-23-3_L2.9-W1.3-P1.90-LS2.4-BR
  rect 1.25x0.7 smd: 1(1,-0.95) 2(1,0.95) 3(-1,0)
SOT-23-5_L3.0-W1.7-P0.95-LS2.8-BR
  rect 1.1x0.6 smd: 1(1.3,-0.95) 2(1.3,0) 3(1.3,0.95) 4(-1.3,0.95) 5(-1.3,-0.95)
SOT-23-6_L2.9-W1.6-P0.95-LS2.8-BR
  rect 1.1x0.6 smd: 1(1.35,-0.95) 2(1.35,0) 3(1.35,0.95) 4(-1.35,0.95) 5(-1.35,0) 6(-1.35,-0.95)
SOT-23_L2.9-W1.3-P1.90-LS2.4-BR
  rect 1x0.8 smd: 1(1.15,-0.95) 2(1.15,0.95) 3(-1.15,0)
SW-SMD_L6.1-W3.6-LS8.0
  rrect 1.4x1.5 smd: 1(-3.8,0) 2(3.8,0)
SW-SMD_SS-3235S-LX
  rect 1.2x1.8 smd: 1(-2.5,3.05) 2(0,3.05) 3(2.5,3.05) 4(-2.5,-3.05) 5(0,-3.05) 6(2.5,-3.05)
TF-SMD_TF-02
  rect 0.7x1.6 smd: 1(2.245,5.3) 2(1.145,5.3) 3(0.046,5.3) 4(-1.054,5.3) 5(-2.155,5.3) 6(-3.255,5.3) 7(-4.354,5.3) 8(-5.454,5.3) 9(-6.554,5.3)
  rect 1.2x1.5 smd: 10(-7.754,4.3)
  rect 1.2x2.2 smd: 11(-7.746,-5.3) 12(7.754,-5.3)
  rect 1.6x1.5 smd: 13(6.854,4.3)
TO-92-3_L4.9-W3.7-P1.27-L
  rect 0.9x1.6 hole 0.7: 1(-1.27,0)
  oval 0.9x1.6 hole 0.7: 2(0,0) 3(1.27,0)
TSSOP-28_L9.7-W4.4-P0.65-LS6.4-BL
  oval 0.343x1.732 smd: 1(-4.225,-2.866) 2(-3.575,-2.866) 3(-2.925,-2.866) 4(-2.275,-2.866) 5(-1.625,-2.866) 6(-0.975,-2.866) 7(-0.325,-2.866) 8(0.325,-2.866) 9(0.975,-2.866) 10(1.625,-2.866) 11(2.275,-2.866) 12(2.925,-2.866) 13(3.575,-2.866) 14(4.225,-2.866) 15(4.225,2.866) 16(3.575,2.866) 17(2.925,2.866) 18(2.275,2.866) 19(1.625,2.866) 20(0.975,2.866) 21(0.325,2.866) 22(-0.325,2.866) 23(-0.975,2.866) 24(-1.625,2.866) 25(-2.275,2.866) 26(-2.925,2.866) 27(-3.575,2.866) 28(-4.225,2.866)
USB-A-TH_AF-WJDG
  round 1.7 hole 1.1: 1(-3.521,1.355) 2(-1.018,1.355) 3(0.981,1.355) 4(3.48,1.355)
  round 3.2 hole 2.3: 5(-6.57,-1.355) 5(6.57,-1.355)
USB-C-SMD_TYPE-C-6PIN-2MD-073
  rect 0.55x1.1 smd: 1(-3.2,2.375) 2(-2.4,2.375) 11(2.4,2.375) 12(3.2,2.375)
  rect 0.3x1.1 smd: 3(-1.75,2.375) 4(-1.25,2.375) 5(-0.75,2.375) 6(-0.25,2.375) 7(0.25,2.375) 8(0.75,2.375) 9(1.25,2.375) 10(1.75,2.375)
  oval 1.1x2 hole 0.6x1.5: 13(-4.325,1.825) 14(4.325,1.825)
  oval 1.2x1.8 hole 0.6x1.2: 13(-4.325,-2.375) 14(4.325,-2.375)

## Nets
As in the schematic.

Pads without a net: BEEP1 3 4; J3 3 9; J7 1 15 16 17 23 25 26 28; J8 18; J11 4 5; J12 4 5; J13 1 8 9; J20 3 9; U2 3 5 12 13 14; U11 9; U14 2 6 7 17 18 19 20 26

## Via types
v1: diameter 0.61, hole 0.305, Top Layer to Bottom Layer, 624 vias

## Routing (per net, layer and track width the routed paths; a pad name or vN(x,y) marks a point on that pad's centre or on a via; arc(x,y) is an arc through that point)
+V3.3: length 59.3
  Top Layer w0.381: v1(37.97,56.77) 34.8,56.77 33.9,57.67 v1(30.23,57.67) ; v1(54.67,38.16) v1(54.67,42.8)
  Bottom Layer w0.381: v1(37.97,56.77) 38.85,56.77 38.86,56.77 U17.16 38.86,52.08 41.02,49.91 41.02,44.07 ; 41.02,44.07 41.02,43.31 41.53,42.8 v1(54.67,42.8) ; 41.02,44.07 C73.2 U18.8 ; 27.08,56.26 30.23,56.26 ; 27.08,56.26 D9.1 ; 27.08,56.26 C61.2 ; 30.23,56.26 v1(30.23,57.67) ; 30.23,56.26 U16.8 ; R141.2 48.99,38.22 C53.1 v1(54.67,38.16)
-V3.3: length 68.3
  Top Layer w0.381: v1(37.34,61.85) 38.35,61.85 39.24,60.96 43.31,60.96 v1(44.32,59.94) ; v1(27.08,60.59) 27.08,53.44 27.56,52.96 v1(27.56,51.59) ; v1(34.67,46.99) 35.31,46.36 37.97,46.36 39.12,45.21 39.12,41.05 38.14,40.08 v1(38.14,38.99)
  Bottom Layer w0.381: 45.06,38.22 R142.2 ; 45.06,38.22 C54.1 ; 45.06,38.22 38.49,38.22 38.14,38.57 v1(38.14,38.99) ; v1(34.67,46.99) 33.78,47.88 U18.4 C74.2 30.18,50.59 29.19,51.59 v1(27.56,51.59) ; 27.08,61.65 C62.2 ; 27.08,61.65 v1(27.08,60.59) D10.2 ; 27.08,61.65 27.08,63.28 27.95,64.15 33.13,64.15 34.04,63.24 34.04,61.85 ; v1(37.34,61.85) 37.32,61.83 34.06,61.83 34.04,61.85 ; U17.7 46.48,60.45 45.97,59.94 v1(44.32,59.94) ; 34.04,61.73 34.04,61.85
AGND: length 40.2
  Bottom Layer w0.254: U14.22 36.12,72.32 v1(36.45,72.64) 36.12,72.97 34.49,72.97 ; C79.2 24,83.94 C31.1 v1(22.86,83.94) ; C45.2 v1(22.68,71.3) ; JP1.2 v1(44.18,89.35) ; U14.28 35.21,68.42 36.24,67.4 C41.2 C40.1 v1(39.12,67.4) ; C86.1 C39.2 v1(22.86,86.61) ; v1(27.69,78.54) C47.2 C46.1 ; U14.11 v1(30.23,74.92) ; v1(38.73,77.91) C43.2 36.12,77.91 35.09,76.87 U14.15 ; v1(15.42,86.87) R140.2 ; v1(15.42,83.41) R138.2 ; R136.2 v1(17.65,72.72) ; R128.2 v1(26.8,80.01) ; 38.97,81.04 v1(39.75,81.04) ; 40.26,86.61 v1(40.26,85.83) ; R135.2 v1(17.65,71.19)
  Bottom Layer w0.381: v1(32.89,84.07) U13.4 37.33,84.07 C35.1
GND: length 156.1
  Top Layer w0.254: v1(122,39.49) 122,40.64 v1(120.85,40.64) ; J13.10 v1(12.7,49.71) ; 139.68,3.38 v1(139.68,1.89) ; R179.1 126.55,90.87 C78.2 C26.2 ; D1.2 v1(97.28,48.01) ; D1.2 v1(95.81,49.47) ; D1.2 v1(97.28,50.94) ; D1.2 v1(98.75,49.47) ; v1(118.06,97.41) 119.35,97.41 C25.1 ; 163.56,9.23 v1(163.56,7.75) ; BAT.2 59.06,39.37 58.93,39.24 v1(57.91,39.24) ; BAT.2 v1(56.9,42.16) ; BAT.2 59.06,44.96 59.18,45.08 v1(60.2,45.08) ; J13.6 v1(13.08,45.21) ; C21.1 v1(66.29,63.12) ; SW_2.2 v1(153.84,7.75) ; U8.1 v1(55.73,65.41) ; U9.14 v1(84.84,56.26) ; J13.12 6.18,34.2 v1(6.86,33.53) ; U7.3 v1(74.45,36.58) ; v1(119.15,91.38) 119.15,91.77 119.39,92.01 U10.13 ; S3.1 v1(55.88,13.97) ; v1(116.69,86.24) 116.69,86.64 116.46,86.87 115.28,86.87 U10.8 ; C5.2 v1(100.2,50.42) ; C3.1 v1(113.54,58.67) ; 71.88,32.32 v1(72.66,32.32) ; NTC.1 v1(26.54,63.7) ; U8.10 v1(55.73,53.97) ; C20.2 v1(82.58,30.68) ; v1(115.83,49.73) U1.17 v1(113.48,49.73) ; 129.71,3.38 v1(129.71,1.89) ; U7.2 v1(74.45,35.31) ; 163.56,16.6 v1(163.56,15.11) ; J13.11 v1(5.49,49.7) ; U7.4 v1(74.45,37.85) ; C18.2 v1(72.64,30.68) ; v1(122.02,46.25) C2.1 v1(120.86,45.09) ; Q4.2 150.75,92.12 v1(150.75,91.38) ; SW_4.2 v1(153.84,15.11) ; 81.31,32.32 v1(82.59,32.32) ; U6.4 v1(84.58,37.79) ; U7.1 v1(74.45,34.04) ; U7.7 v1(71.85,35.31)
  Bottom Layer w0.254: v1(13.08,45.21) 13.08,44.82 C52.2 ; v1(18.04,56.86) 18.08,56.86 R147.1 ; R51.1 v1(153.12,20.09) 152.38,20.09 C24.2 ; C29.2 C30.1 62.17,11.06 J8.20 ; v1(11.73,42.98) 10.96,42.98 10.95,42.98 ; D11.2 26.86,53 C67.2 v1(25.91,54.05) ; R167.2 27.45,46.55 C69.1 C72.2 28.78,46.62 C74.1 v1(28.78,49.66) ; U11.13 119.37,90.74 119.15,90.96 v1(119.15,91.38) ; v1(11.73,44.62) 10.96,44.62 C10.2 ; R21.1 v1(2.67,17.56) R20.1 ; 37.45,52.53 v1(37.45,55.37) ; C16.1 v1(138.88,92.65) 138.88,93.66 U4.2 ; v1(149.1,87.38) 149.1,88.38 C15.2 149.09,89.4 v1(149.1,89.41) ; U11.8 v1(116.94,95.82) ; U17.8 47.75,60.33 48.13,59.94 v1(48.89,59.94) ; C68.2 27.81,65.21 v1(27.31,64.7) ; 145.41,63.75 v1(145.44,63.72) R67.2 ; C8.2 5.03,42.98 v1(4.26,42.98) ; R183.1 71.71,15.07 v1(71.37,14.73) 71.37,14.01 R120.1 ; R15.1 v1(2.67,27.72) R16.1 ; C28.1 95.49,23.69 C27.2 95.5,22.04 v1(95.5,21.08) ; R149.1 v1(46.15,63.5) ; C76.2 v1(39.75,49.26) ; C7.1 69.22,42.55 v1(70.1,42.55) ; JP1.1 v1(47.28,89.34) ; C66.2 32.95,49.85 v1(32.64,49.53) ; C85.1 120.14,85.34 ; 11.52,40.9 v1(11.52,42.29) ; v1(66.29,63.12) C22.2 66.28,64 C80.1 ; C73.1 v1(40.39,42.67) ; R31.2 v1(35.81,37.47) ; C62.1 v1(24.38,61.65) ; C60.1 v1(21.59,60.51)
  Bottom Layer w0.381: R149.1 45.21,63.26 U17.6 ; 130.6,84.97 v1(131.43,84.97)
  Bottom Layer w0.508: v1(27.05,33.66) U5.5 ; C23.1 v1(24.62,39.08) R32.2 v1(22.69,39.08) 21.56,39.08 J5.4 ; C14.1 v1(39.12,26.73) C13.2 38.36,26.74 v1(38.36,27.51) R78.1 ; 35.5,28.32 v1(34.58,28.32) ; U3.2 v1(35.31,26.03) ; J9B.1 J9.1 ; v1(48.45,32.18) U15.4 ; 45,36.76 45.05,36.71 C55.2 ; Q13.2 v1(42.34,30.16) ; 53.48,45.97 55.62,45.97 v1(56.13,46.48) ; C12.1 v1(31.62,27.65) ; 49.05,36.76 49,36.71 49,35.31 ; C11.2 v1(30.23,27.65)
  vias: v1(8.07,31.15) v1(8.07,24.29) v1(8.07,20.99) v1(8.07,14.13) v1(9.14,32.89) v1(12.45,33.4) v1(14.73,34.42) v1(24.77,55.88) v1(38.35,37.21) v1(38.35,36.41) v1(50.17,33.15) v1(64.9,24) v1(65.47,63.99) v1(66.8,25.91) v1(66.8,24) v1(66.8,22.1) v1(68.71,25.91) v1(68.71,24) v1(68.71,22.1) v1(70.61,25.91) v1(70.61,24) v1(70.61,22.1) v1(72.52,25.91) v1(72.52,24) v1(72.52,22.1) v1(74.42,24) v1(93.6,66.55) v1(96.65,58.29) v1(97.54,62.86) v1(97.68,42.23) v1(97.68,40.81) v1(98.81,60.96) v1(99.1,43.64) v1(99.1,42.23) v1(99.1,40.81) v1(99.82,55.5) v1(100.52,43.64) v1(100.52,42.23) v1(100.52,40.81) v1(101.94,45.06) v1(101.94,43.64) v1(101.94,42.23) v1(101.94,40.81) v1(102.49,50.93) v1(103.36,46.48) v1(103.36,45.06) v1(103.36,43.64) v1(103.36,42.23) v1(103.36,40.81) v1(104.78,46.48) v1(104.78,45.06) v1(104.78,43.64) v1(104.78,42.23) v1(104.78,40.81) v1(104.9,60.83) v1(105.54,54.48) v1(106.19,46.48) v1(106.19,45.06) v1(106.19,43.64) v1(106.19,42.23) v1(106.19,40.81) v1(107.93,48.58) v1(108.2,60.45) v1(108.94,52.12) v1(108.94,50.7) v1(108.94,49.29) v1(108.94,47.87) v1(109.94,52.83) v1(109.94,51.41) v1(109.94,50) v1(109.94,48.58) v1(110.36,61.42) v1(110.87,81.53) v1(110.94,52.12) v1(111.94,52.83) v1(111.94,51.41) v1(111.94,50) v1(111.94,48.58) v1(112.78,81.53) v1(112.9,65.7) v1(112.9,64.28) v1(112.9,62.86) v1(112.9,61.45) v1(112.95,52.12) v1(112.95,47.87) v1(114.43,54.74) v1(114.43,46.48) v1(114.43,45.06) v1(114.43,43.64) v1(114.43,42.23) v1(114.43,40.81) v1(114.68,81.53) v1(115.44,65.7) v1(115.44,64.28) v1(115.44,62.86) v1(115.44,61.45) v1(115.44,59.69) v1(116.08,54.74) v1(116.65,48.32) v1(117.73,56.13) v1(117.73,46.48) v1(117.73,45.06) v1(117.73,43.64) v1(117.73,42.23) v1(117.73,40.81) v1(119.13,49.73) v1(120.05,85.34) v1(120.86,49.73) v1(120.86,48.01) v1(120.86,46.25) v1(120.86,43.94) v1(120.85,41.8) v1(120.85,39.49) v1(122.59,48.01) v1(123.19,62.74) v1(123.17,46.25) v1(123.16,39.49) v1(123.57,60.58) v1(124.08,53.34) v1(124.32,48.01) v1(124.32,46.25) v1(124.31,39.49) v1(124.71,54.99) v1(124.84,58.17) v1(125.35,90.42) v1(125.48,46.25) v1(125.47,39.49) v1(126.11,66.17) v1(126.17,90.42) v1(126.17,89.62) v1(128.27,46.25) v1(128.27,45.09) v1(128.27,43.94) v1(128.27,42.87) v1(128.26,41.8) v1(128.26,40.64) v1(128.26,39.49) v1(150.05,88.39)
(no net):
  vias: v1(0,0)
A: length 5.8
  Bottom Layer w0.254: J5.2 21.95,34.92 U5.6 ; R33.2 R102.1
ADC3: length 84.4
  Top Layer w0.254: U1.46 102.25,48.72 99.04,45.51 96.31,45.51 95.13,44.33 95.13,41.85 94.88,41.6 93.85,41.6 ; v1(49.79,51.56) 47.63,53.72 43.81,53.72 43.18,54.36 43.18,57.66 42.72,58.12 JUP2.2 ; v1(59.06,47.12) 59.06,46.35 59.46,45.95 90.83,45.95 92.58,44.2 92.58,41.91 92.91,41.58 S1.46
  Bottom Layer w0.254: v1(49.79,51.56) 50.8,51.56 53.9,48.46 58.09,48.46 59.06,47.5 v1(59.06,47.12)
B: length 5.8
  Bottom Layer w0.254: J5.3 21.95,36.19 U5.7 ; R32.1 R102.2
COM0: length 63
  Top Layer w0.254: U10.15 118.43,94.55 117.86,95.12 117.86,96.27 117.35,96.77 112.65,96.77 111,95.12 106.16,95.12 104.7,93.66 64.91,93.66 LED4_A.12
COM1: length 50.5
  Top Layer w0.254: v1(69.47,93.08) 104.94,93.08 106.35,94.49 111.51,94.49 112.84,95.82 U10.1
  Bottom Layer w0.254: LED4_A.9 v1(69.47,93.08)
COM2: length 48.3
  Top Layer w0.254: U10.2 112.71,94.55 112.01,93.85 106.54,93.85 105.18,92.49 v1(72.01,92.49)
  Bottom Layer w0.254: v1(72.01,92.49) LED4_A.8
COM3: length 46.7
  Top Layer w0.254: U10.3 106.79,93.28 105.42,91.91 v1(74.55,91.91)
  Bottom Layer w0.254: v1(74.55,91.91) LED4_A.6
COM4: length 29.1
  Top Layer w0.254: U10.4 112.59,92.01 111.89,92.71 107.05,92.71 105.66,91.33 v1(92.34,91.33)
  Bottom Layer w0.254: v1(92.34,91.33) LED4_B.12
COM5: length 21.3
  Top Layer w0.254: U10.5 112.59,90.74 111.25,92.08 107.24,92.08 v1(106.43,91.26)
  Bottom Layer w0.254: v1(106.43,91.26) 106.43,91.69 106.28,91.84 100.31,91.84 99.96,92.19 LED4_B.9
COM6: length 22.9
  Top Layer w0.254: U10.6 112.71,89.47 109.83,86.59 108.6,86.59 107.25,87.93 v1(107.25,91.26)
  Bottom Layer w0.254: v1(107.25,91.26) 107.25,92.14 106.93,92.46 102.74,92.46 102.5,92.7 LED4_B.8
COM7: length 11.3
  Top Layer w0.254: LED4_B.6 107.08,86.46 107.53,86 110.39,86 112.59,88.2 U10.7
D+: length 29.6
  Top Layer w0.254: J2.2 16.7,17.08 16.51,16.89 16.51,13.76 J4.3 ; 8.55,17.81 v1(8.55,18.4) ; 8.55,17.81 8.55,17.01 8.36,16.81 J3.8 ; 8.55,17.81 J3.6
  Bottom Layer w0.254: R45.2 5.24,19.9 5.59,19.56 5.59,18.79 5.99,18.4 v1(8.55,18.4) 16.11,18.4 16.7,18.99 J2.2
D-: length 29.6
  Top Layer w0.254: J3.5 6.46,18.31 6.27,18.12 6.27,17.31 ; J2.3 14.2,20.51 14.02,20.33 13.51,20.33 13.33,20.16 13.33,19.75 13.51,19.57 14.02,19.57 14.2,19.39 14.2,18.99 14.02,18.81 13.55,18.81 13.37,18.63 13.37,18.23 13.55,18.05 14.02,18.05 14.2,17.87 14.2,15.39 14.45,15.14 J4.2 ; 6.27,17.31 5.76,17.31 5.59,17.14 v1(5.59,16.51) ; 6.27,17.31 J3.7
  Bottom Layer w0.254: J4.2 14.45,15.9 13.85,16.51 v1(5.59,16.51) 5.59,15.49 5.32,15.22 R43.2
DATA2: length 6.9
  Top Layer w0.254: v1(123.06,86.93) U10.9
  Bottom Layer w0.254: v1(123.06,86.93) 123.06,89.02 122.61,89.47 U11.14
HPLO: length 14.6
  Bottom Layer w0.254: U14.9 21.04,73.62 20.59,73.16 C48.1
HPRO: length 10.6
  Bottom Layer w0.254: C49.1 20.59,74.68 20.99,74.27 U14.10
J1A-1: length 22.7
  Top Layer w0.254: J1.1 26.29,50.42 23.5,53.21 v1(22.61,53.21)
  Bottom Layer w0.254: 21.85,53.21 v1(22.61,53.21)
J1A-2: length 43.5
  Top Layer w0.254: C59.2 19.31,53.8 23.74,53.8 26.53,51 35.13,51 36.82,52.69 47.76,52.69 48.79,51.67 J1.2
  Bottom Layer w0.254: R144.2 C59.2 14.86,58.17 C58.1
J1B-1: length 198.4
  Top Layer w0.254: 114.64,74.43 114.64,72.82 115.8,71.65 127.29,71.65 129.74,69.2 129.74,60.27 128.83,59.36 S1.22 ; J1.4 50.93,47.88 54.28,51.23 v1(78.61,51.23) ; U9.23 74.68,62.74 75,62.42 76.65,62.42 78.61,60.46 v1(78.61,60.44) ; v1(114.64,79.32) 82.5,79.32 v1(81.91,78.74) ; U1.22 117.26,52.23 120.22,55.19 120.22,57.48 122.12,59.38 126.87,59.38
  Bottom Layer w0.254: v1(81.91,78.74) 76.58,73.41 76.58,66.39 78.61,64.37 v1(78.61,60.44) v1(78.61,51.23) 78.61,19.69 86.43,11.87 J8.10 ; v1(114.64,79.32) 114.64,74.43
J1B-2: length 19.3
  Top Layer w0.254: v1(27.45,48.77) 28.83,48.77 29.59,48.01 33.91,48.01 35.75,49.84 40.58,49.84 41.28,49.15 41.28,48.26 41.66,47.88 J1.3
  Bottom Layer w0.254: R166.2 v1(27.45,48.77)
J1C-1: length 164.2
  Top Layer w0.254: v1(131.5,64.44) 131.5,70.48 v1(129.15,72.82) ; v1(101.85,72.82) 81.23,72.82 79.99,74.06 59.26,74.06 56.86,71.65 v1(50.01,71.65) ; U1.24 116.54,53.23 119.05,55.74 119.05,62.92 119.78,63.65 124.86,63.65 125.67,64.46 126.87,64.46 ; J1.6 46.86,45.34 46.48,45.72 46.48,48.64 46.86,49.02 50.55,49.02 51.18,49.66 51.18,51.18 50.01,52.35 v1(50.01,57.05)
  Bottom Layer w0.254: S1.24 v1(131.5,64.44) ; v1(50.01,57.05) v1(50.01,71.65) 34.5,71.65 34.49,71.67 ; v1(101.85,72.82) v1(129.15,72.82)
J1C-2: length 7.2
  Top Layer w0.254: J1.5 45.72,45.34 46.99,44.07 v1(49.15,44.07)
  Bottom Layer w0.254: v1(49.15,44.07) R3.2
J3-23: length 4.8
  Bottom Layer w0.254: R91.1 R98.2
J3-24: length 4.8
  Bottom Layer w0.254: R83.2 R92.1
J3-25: length 4.8
  Bottom Layer w0.254: R100.2 R93.1
J3-26: length 4.8
  Bottom Layer w0.254: R101.2 R94.1
J3-27: length 2.4
  Bottom Layer w0.254: 119.52,26.11 R95.1
J18A-1: length 55.2
  Top Layer w0.254: 43.3,36.96 41.66,36.96 41.28,36.58 41.28,34.08 38.52,31.33 31.89,31.33 30.44,32.78 30.44,37.38 26.66,41.15 19.8,41.15 19.55,40.91 v1(19.55,40.57) ; v1(5.72,39.42) 5,40.13 3.26,40.13 v1(2.62,39.5)
  Bottom Layer w0.254: v1(5.72,39.42) 11.98,39.42 12.57,40 15.24,40 16.76,41.53 19.05,41.53 19.55,41.03 v1(19.55,40.57) ; U2.1 v1(2.62,39.5)
J18A-2: length 199.8
  Top Layer w0.254: S1.7 111.63,31.24 110.36,29.97 88.13,29.97 85.97,27.81 v1(75.69,27.81) 63.12,27.81 62.23,26.92 62.23,20.83 58.67,17.27 v1(48.01,17.27) 45.01,20.27 45.01,31.04 46.48,32.51 46.48,36.19 47.24,36.96 48.9,36.96 ; v1(25.78,30.73) 23.55,28.5 v1(23.55,23.01) ; J6.2 32.03,5.11 33.85,6.92 v1(33.85,11.86) R37.1 R34.1 ; U1.7 110.62,36.97 111.65,35.94 111.65,33.98 ; v1(75.69,39.55) 77.29,39.55 77.98,38.86 77.98,36.83 78.29,36.52 U6.6
  Bottom Layer w0.254: v1(25.78,30.73) 30.61,30.73 31.03,31.15 R29.2 ; U5.4 R29.2 ; R29.2 R30.1 ; v1(23.55,23.01) 31.47,23.01 32.5,21.98 32.5,17.28 33.85,15.94 v1(33.85,11.86) 45.83,11.86 48.01,14.03 v1(48.01,17.27) ; v1(75.69,39.55) v1(75.69,27.81)
J18B-1: length 40.4
  Top Layer w0.254: J18.7 43.3,33.27 43.05,33.01 41.03,33.01 38.76,30.74 31.65,30.74 29.86,32.53 29.86,37.13 26.42,40.57 v1(20.34,40.57)
  Bottom Layer w0.254: D3.2 15.4,41.18 16.13,41.91 19.56,41.91 20.34,41.13 v1(20.34,40.57)
J18B-2: length 202
  Top Layer w0.254: J6.3 34.53,5.83 35.05,6.35 v1(35.05,12.45) ; v1(107.7,50.22) 107.34,50.22 106.84,50.72 U1.42 ; v1(24.13,23.59) 24.13,27.91 v1(26.37,30.15) ; J18.8 48.01,34.42 47.12,33.53 47.12,32.26 45.59,30.73 45.59,20.51 v1(47.42,18.68) 48.25,17.86 58.43,17.86 61.65,21.07 61.65,38.79 64.67,41.81 82.39,41.81 83.44,40.77 83.44,36.58 84.77,35.25 U6.2 v1(91.41,35.25) ; R35.2 v1(33.09,21.08) R36.1
  Bottom Layer w0.254: v1(26.37,30.15) 35.74,30.15 36.7,31.11 36.7,37.72 35.94,38.48 33.53,38.48 32.93,39.08 D8.2 ; v1(107.7,50.22) 104.34,50.22 102.8,51.76 93.85,51.74 92.38,51.74 91.41,50.77 v1(91.41,35.25) ; v1(24.13,23.59) 31.72,23.59 33.09,22.22 v1(33.09,21.08) 33.09,17.71 35.05,15.75 v1(35.05,12.45) 45.59,12.45 47.42,14.28 v1(47.42,18.68)
J18C-1: length 48.7
  Top Layer w0.254: v1(17.98,40.57) 17.98,41.34 18.95,42.32 27.15,42.32 31.62,37.85 31.62,33.4 32.53,32.5 38.04,32.5 40.13,34.59 40.13,37.27 40.64,37.78 40.64,40.13 42.55,42.04 J18.1
  Bottom Layer w0.254: v1(17.98,40.57) 15.89,38.48 15.24,38.48 14.86,38.1 14.86,35.94 14.35,35.43 13.08,35.43 D4.2
J18C-2: length 249.8
  Top Layer w0.254: 42.03,11.99 J6.6 ; 42.03,11.99 42.03,13.97 ; 42.03,11.99 v1(99.13,11.99) v1(111.9,11.99) ; 42.03,13.97 S2.1 ; 42.03,13.97 42.03,20.25 43.84,22.06 43.84,31.52 45.21,32.89 45.21,40.39 46.86,42.04 J18.2 ; U1.13 115.59,47.73 115.95,47.37 115.95,39.5 116.59,38.86 118.43,38.86 119.9,37.39 125.99,37.39 S1.13 127.81,35.56 v1(127.81,32.75) ; v1(111.9,21.46) 125.09,21.46 127.81,24.18 v1(127.81,28.66) ; U9.27 69.6,61.47 70.4,60.67 75.6,60.67 79.43,56.84 v1(82.93,56.84)
  Bottom Layer w0.254: R92.2 v1(111.9,21.46) v1(111.9,11.99) ; J8.5 v1(99.13,11.99) 99.13,12.5 81.53,30.1 81.53,53.47 82.93,54.86 v1(82.93,56.84) ; v1(127.81,28.66) v1(127.81,32.75)
J18D-1: length 57.8
  Top Layer w0.254: J18.3 41.66,39.5 41.28,39.12 41.28,37.59 40.64,36.96 40.64,34.27 38.28,31.91 32.13,31.91 31.03,33.02 31.03,37.62 26.91,41.74 19.38,41.74 18.76,41.12 v1(18.76,40.57)
  Bottom Layer w0.254: 3.89,35.36 3.89,36.15 4.7,36.96 11.94,36.96 12.7,36.19 13.97,36.19 14.22,36.45 14.22,38.61 14.86,39.24 15.49,39.24 17.4,41.15 18.54,41.15 18.76,40.93 v1(18.76,40.57)
J18D-2: length 249.8
  Top Layer w0.254: S1.14 128.4,37.52 v1(128.4,33.34) ; U1.14 115.91,48.23 116.53,47.61 116.53,39.74 116.83,39.44 118.67,39.44 120.14,37.97 125.79,37.97 126.87,39.06 ; v1(81.66,58.6) 80.46,58.6 79.42,59.63 79.42,60.54 76.97,62.99 76.06,62.99 75.95,63.11 U9.22 ; J6.5 39.53,5.93 39.16,6.3 39.16,15.67 40.41,16.92 v1(40.41,18.75) S2.4 ; 128.4,29.13 128.4,23.94 125.34,20.88 v1(109.36,20.88) ; J18.4 47.12,39.5 45.85,38.23 45.85,32.64 44.42,31.22 44.42,21.82 42.62,20.01 v1(42.62,18.75) 42.62,13.01 43.05,12.57 v1(96.59,12.57) v1(109.36,12.57)
  Bottom Layer w0.254: v1(81.66,58.6) 81.66,55.12 80.94,54.4 80.94,28.22 v1(96.59,12.57) J8.6 ; v1(40.41,18.75) v1(42.62,18.75) ; v1(128.4,29.25) v1(128.4,33.34) ; R91.2 v1(109.36,20.88) v1(109.36,12.57)
LED_A: length 57
  Top Layer w0.254: LED4_A.11 65.69,95.41 93.58,95.41 LED4_B.11 ; v1(107.52,86.84) 106.67,87.69 106.67,90.06 106.05,90.68 v1(105.36,90.68)
  Bottom Layer w0.254: LED4_B.11 94.88,91.43 95.63,90.68 v1(105.36,90.68) ; v1(107.52,86.84) 108.7,85.66 R70.2
LED_B: length 49
  Top Layer w0.254: LED4_B.7 102.57,94.25 v1(74.55,94.25) ; v1(108.08,91.26) 108.08,87.93 v1(108.84,87.17)
  Bottom Layer w0.254: LED4_B.7 105.04,93.2 105.21,93.04 107.49,93.04 108.08,92.45 v1(108.08,91.26) ; R71.2 109.08,86.93 v1(108.84,87.17) ; LED4_A.7 v1(74.55,94.25)
LED_C: length 44.5
  Top Layer w0.254: LED4_A.4 71.35,88.34 v1(99.96,88.34)
  Bottom Layer w0.254: R72.2 111.12,88.34 v1(99.96,88.34) LED4_B.4
LED_D: length 51.2
  Top Layer w0.254: LED4_A.2 67.44,89.51 v1(94.88,89.51)
  Bottom Layer w0.254: R73.2 111.22,89.51 v1(94.88,89.51) LED4_B.2
LED_E: length 54.8
  Top Layer w0.254: LED4_A.1 65.49,90.09 v1(92.34,90.09)
  Bottom Layer w0.254: R74.2 110.75,90.74 110.1,90.09 v1(92.34,90.09) LED4_B.1
LED_F: length 53.3
  Top Layer w0.254: LED4_B.10 95.54,94.83 v1(66.93,94.83)
  Bottom Layer w0.254: LED4_B.10 97.42,91.81 97.97,91.26 105.6,91.26 106.18,90.68 109.84,90.68 110.24,91.07 110.24,91.69 110.55,92.01 R75.2 ; 66.93,96.72 v1(66.93,94.83)
LED_G: length 46.5
  Top Layer w0.254: v1(109.6,91.26) 109.6,87.76 ; LED4_A.5 73.31,87.76 v1(102.5,87.76) LED4_B.5
  Bottom Layer w0.254: v1(109.6,91.26) 109.6,93.09 109.79,93.28 R76.2 ; v1(102.5,87.76) v1(109.6,87.76)
LED_H: length 53.2
  Top Layer w0.254: 108.84,88.93 v1(108.84,91.26) ; v1(97.42,88.92) 69.4,88.92 66.93,86.46
  Bottom Layer w0.254: v1(108.84,91.26) 108.84,94.11 109.28,94.55 R77.2 ; v1(108.84,88.92) v1(97.42,88.92) LED4_B.3
MCU-VCC: length 90.9
  Top Layer w0.254: v1(107.25,51.22) U1.41 v1(104.89,51.22)
  Top Layer w0.762: S1.41 89.46,54.28 88.52,53.34 88.52,51.18 87.63,50.29 55.25,50.29 51.18,46.23 v1(51.18,27.57) ; v1(104.89,51.22) 104.23,51.22 102.87,52.58 C5.1 99.82,52.58 98.1,54.3 93.85,54.3
  Bottom Layer w0.762: R79.1 49.79,25.03 51.18,26.42 v1(51.18,27.57) ; v1(104.89,51.22) v1(107.25,51.22)
P0.0: length 167.6
  Top Layer w0.254: 93.85,56.84 100.43,56.84 v1(102.66,54.61) ; v1(101.85,71.65) v1(77.75,71.65) v1(60.57,71.65) 60.16,71.65 56.67,68.17 56.67,64.55 56.26,64.14 50.03,64.14 46.58,60.68 v1(46.58,58.95) ; U1.40 106.84,51.72 107.34,52.22 v1(107.7,52.22) ; 81.03,61.23 82.49,59.77 90.91,59.77 S1.40 ; R6.2 v1(60.57,76.6) ; U9.11 v1(81.03,56.26)
  Bottom Layer w0.254: U17.11 45.21,57.14 46.58,58.52 v1(46.58,58.95) ; v1(81.03,56.26) v1(81.03,61.27) 81.03,63.6 77.75,66.88 v1(77.75,71.65) ; v1(101.85,71.65) 137.95,71.65 141.08,74.78 R42.2 ; v1(60.57,76.6) v1(60.57,71.65) ; v1(107.7,52.22) 104.5,52.22 102.66,54.06 v1(102.66,54.61)
P0.1: length 163
  Top Layer w0.254: U9.12 v1(82.3,56.26) ; S1.39 92.87,60.35 82.73,60.35 v1(82.3,60.79) ; 93.85,59.38 99.88,59.38 100.49,58.76 100.49,57.6 103.25,54.85 103.25,53.47 104.5,52.22 U1.39 ; R7.2 v1(62.33,76.6) ; v1(47.16,58.37) 47.16,60.44 49.59,62.86 U8.3 56.77,62.86 57.25,63.35 57.25,67.93 60.4,71.07 v1(62.33,71.07) v1(78.46,71.07) v1(101.22,71.07)
  Bottom Layer w0.254: U17.10 46.48,57.32 47.16,58.01 v1(47.16,58.37) ; v1(101.22,71.07) 138.63,71.07 140.82,73.26 R22.2 ; v1(78.46,71.07) 78.46,66.99 82.3,63.16 v1(82.3,60.79) v1(82.3,56.26) ; v1(62.33,76.6) v1(62.33,71.07)
P0.2: length 162.4
  Top Layer w0.254: v1(47.75,57.78) 47.75,60.19 49.15,61.59 U8.4 57.28,61.59 57.84,62.16 57.84,67.68 60.64,70.48 v1(64.09,70.48) v1(79.17,70.48) v1(100.71,70.48) ; S1.38 v1(83.57,61.9) ; U9.13 v1(83.57,56.26) ; R8.2 v1(64.09,76.6) ; U1.38 104.82,52.72 103.84,53.71 103.84,55.09 101.08,57.85 101.08,61.23 100.39,61.92 93.85,61.92
  Bottom Layer w0.254: v1(100.71,70.48) 139.32,70.48 140.57,71.73 R44.2 ; v1(83.57,56.26) v1(83.57,61.9) 83.57,62.8 79.17,67.19 v1(79.17,70.48) ; v1(64.09,70.48) v1(64.09,76.6) ; U17.9 v1(47.75,57.78)
